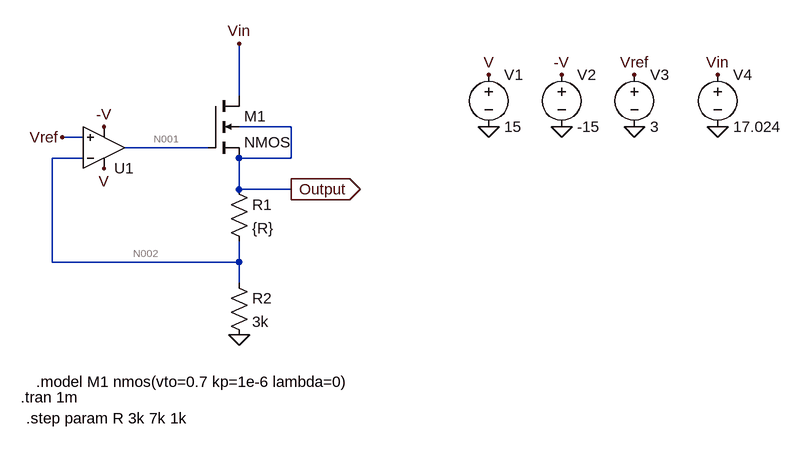
[diagram p0: schematic 2b.asc]
2b.asc, the LTspice schematic file:
Version 4.1
SHEET 1 1228 680
WIRE 384 48 384 -32
WIRE 464 96 384 96
WIRE 144 112 112 112
WIRE 336 128 208 128
WIRE 144 144 96 144
WIRE 464 144 464 96
WIRE 464 144 384 144
WIRE 384 192 384 144
WIRE 464 192 384 192
WIRE 96 304 96 144
WIRE 384 304 384 272
WIRE 384 304 96 304
WIRE 384 336 384 304
FLAG 176 160 V
FLAG 176 96 -V
FLAG 384 416 0
FLAG 112 112 Vref
FLAG 464 192 Output
IOPIN 464 192 Out
FLAG 768 96 0
FLAG 880 96 0
FLAG 992 96 0
FLAG 768 16 V
FLAG 880 16 -V
FLAG 992 16 Vref
FLAG 1120 96 0
FLAG 1120 16 Vin
FLAG 384 -32 Vin
SYMBOL OpAmps\\UniversalOpAmp2 176 128 M180
SYMATTR InstName U1
SYMBOL nmos4 336 48 R0
SYMATTR InstName M1
SYMATTR Value2 l=1u w=10u
SYMBOL res 368 176 R0
SYMATTR InstName R1
SYMATTR Value {R}
SYMBOL res 368 320 R0
SYMATTR InstName R2
SYMATTR Value 3k
SYMBOL voltage 768 0 R0
SYMATTR InstName V1
SYMATTR Value 15
SYMBOL voltage 880 0 R0
SYMATTR InstName V2
SYMATTR Value -15
SYMBOL voltage 992 0 R0
SYMATTR InstName V3
SYMATTR Value 3
SYMBOL voltage 1120 0 R0
SYMATTR InstName V4
SYMATTR Value 17.024
TEXT 72 488 Left 2 !.model M1 nmos(vto=0.7 kp=1e-6 lambda=0)
TEXT 48 512 Left 2 !.tran 1m
TEXT 56 544 Left 2 !.step param R 3k 7k 1k

The netlist it stands for:
* 2b.asc
X§U1 Vref N002 V -V N001 level2 Avol=1Meg GBW=10Meg Slew=10Meg Ilimit=25m Rail=0 Vos=0 En=0 Enk=0 In=0 Ink=0 Rin=500Meg  ; pins In+ In- V+ V- OUT
M1 Vin N001 Output Output NMOS l=1u w=10u
R1 Output N002 {R}
R2 N002 0 3k
V1 V 0 15
V2 -V 0 -15
V3 Vref 0 3
V4 Vin 0 17.024
.model NMOS NMOS
.model PMOS PMOS
.lib standard.mos
.model M1 nmos(vto=0.7 kp=1e-6 lambda=0)
.tran 1m
.step param R 3k 7k 1k
.lib UniversalOpAmp2.lib
.backanno
.end

* Results of the author's LTspice run, read from the files saved beside the schematic
* Operating Point (first step), zero values left out:
*   V(n002) = 3 V
*   V(-v) = -15 V
*   V(n001) = 9.162 V
*   V(output) = 6 V
*   V(vref) = 3 V
*   V(v) = 15 V
*   V(vin) = 17.02 V
*   Id(M1) = 1 mA
*   Is(M1) = -1 mA
*   Ib(M1) = -11.03 pA
*   I(V1) = -1.187 mA
*   I(V3) = -6 nA
*   I(R2) = 1 mA
*   I(R1) = 1 mA
*   I(V2) = 1.187 mA
*   I(V4) = -1 mA
*   Ix(u1:1) = 6 nA
*   Ix(u1:2) = 6 nA
*   Ix(u1:3) = 1.187 mA
*   Ix(u1:4) = -1.187 mA
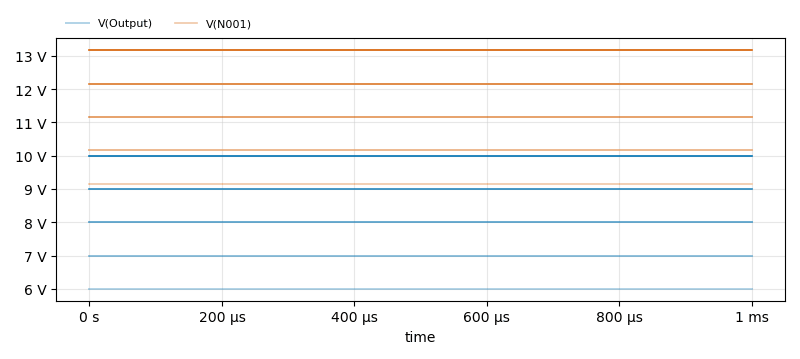
[diagram p1: Transient Analysis of 2b.asc, plotted from the saved traces]
* Transient Analysis, 5 runs:
*   V(Output) [r=3000]: min 6 V, max 6 V, average 6 V, rms 6 V, last 6 V
*   V(Output) [r=4000]: min 7 V, max 7 V, average 7 V, rms 7 V, last 7 V
*   V(Output) [r=5000]: min 8 V, max 8 V, average 8 V, rms 8 V, last 8 V
*   V(Output) [r=6000]: min 9 V, max 9 V, average 9 V, rms 9 V, last 9 V
*   V(Output) [r=7000]: min 10 V, max 10 V, average 10 V, rms 10 V, last 10 V
*   V(N001) [r=3000]: min 9.162 V, max 9.162 V, average 9.162 V, rms 9.162 V, last 9.162 V
*   V(N001) [r=4000]: min 10.16 V, max 10.16 V, average 10.16 V, rms 10.16 V, last 10.16 V
*   V(N001) [r=5000]: min 11.16 V, max 11.16 V, average 11.16 V, rms 11.16 V, last 11.16 V
*   V(N001) [r=6000]: min 12.16 V, max 12.16 V, average 12.16 V, rms 12.16 V, last 12.16 V
*   V(N001) [r=7000]: min 13.16 V, max 13.16 V, average 13.16 V, rms 13.16 V, last 13.16 V